# Altium schematic sheet [02] - Power.SchDoc
size A3
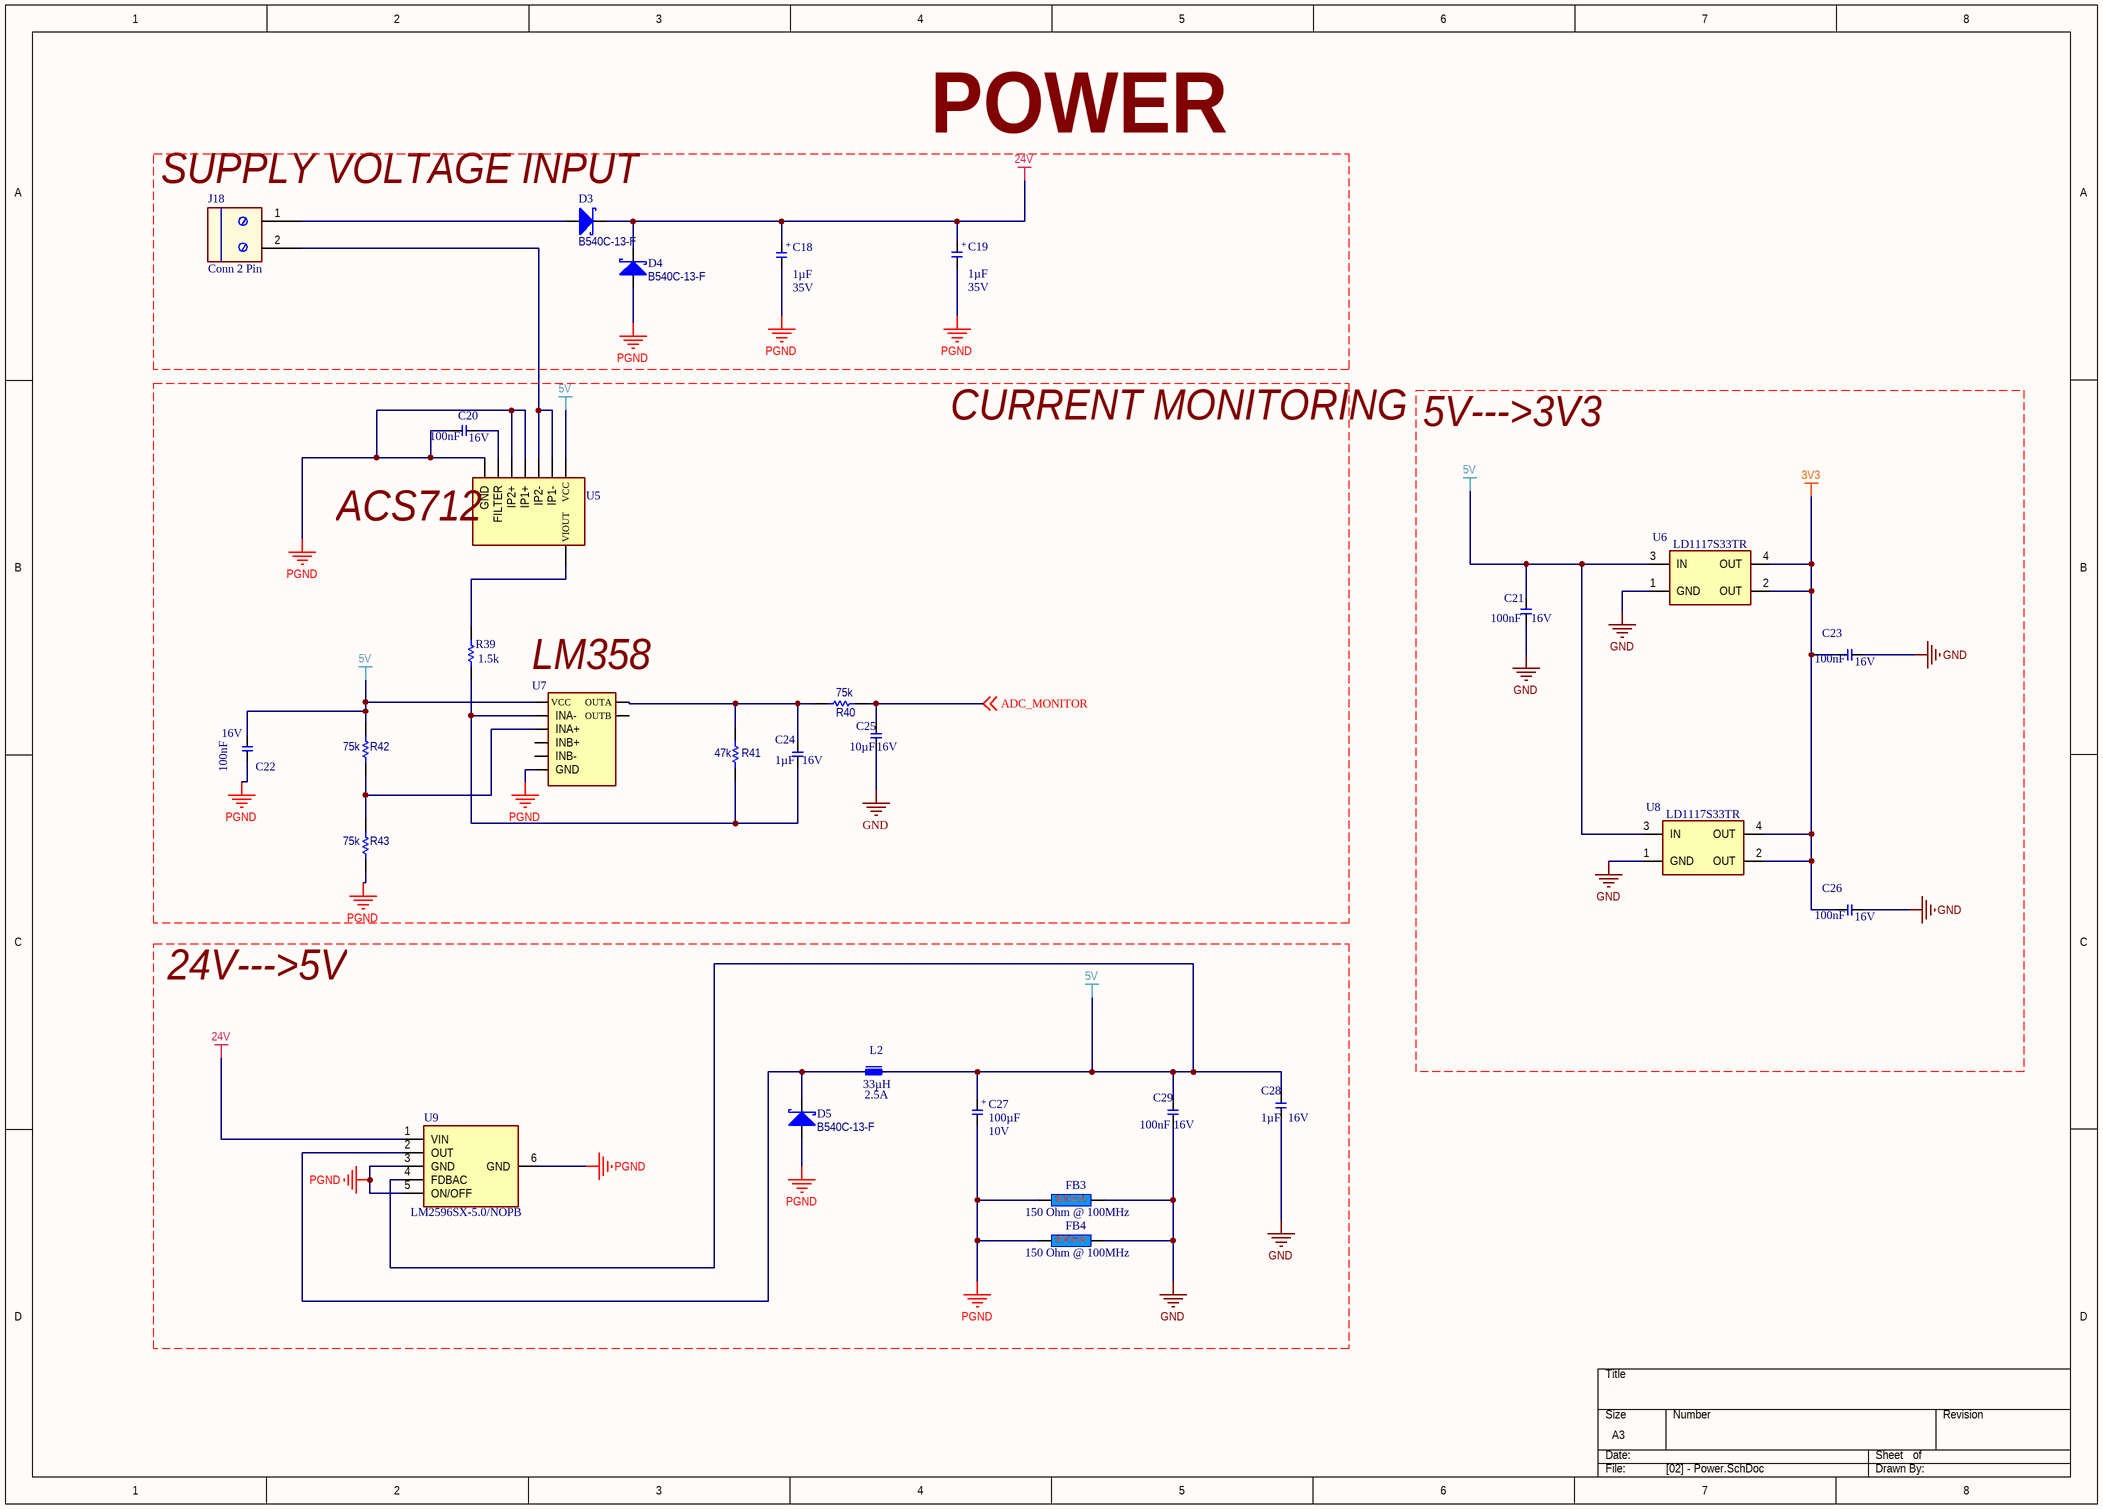
[diagram p0: [02] - Power.SchDoc]

## Parts
C18  Capacitance: 1µF  Voltage - Rated: 35V  [Case_A]  (hidden comment: CAP TANT 1UF 35V 10% 1206)
C19  Capacitance: 1µF  Voltage - Rated: 35V  [Case_A]  (hidden comment: CAP TANT 1UF 35V 10% 1206)
C20  Voltage - Rated: 16V  [C0805]  (hidden comment: 100nF)
C21  100nF  Voltage - Rated: 16V  [C0805]
C22  100nF  Voltage - Rated: 16V  [C0805]
C23  100nF  Voltage - Rated: 16V  [C0805]
C24  Voltage - Rated: 16V  [C0805]  (hidden comment: 1µF)
C25  10µF  Voltage - Rated: 16V  [C0805]
C26  100nF  Voltage - Rated: 16V  [C0805]
C27  Voltage - Rated: 10V  [Case_C]  (hidden comment: 100µF)
C28  1µF  Voltage - Rated: 16V  [C0805]
C29  100nF  Voltage - Rated: 16V  [C0805]
D3  B540C-13-F  [B520C-13-F]
D4  B540C-13-F  [B520C-13-F]
D5  B540C-13-F  [B520C-13-F]
FB3  150 Ohm @ 100MHz  [0805]
FB4  150 Ohm @ 100MHz  [0805]
J18  Conn 2 Pin  [Connector 2 Ways Pitch 3,81]
L2  Inductance: 33µH  Current Rating: 2.5A  [Bobin_SMD]  (hidden comment: L-IND 33UH 2.5A)
R39  1.5k  [R0805]
R40  Resistance (Ohms): 75k  [R1206]  (hidden comment: RES SMD 75K OHM)
R41  Resistance (Ohms): 47k  [R0805]  (hidden comment: RES SMD 47K OHM)
R42  Resistance (Ohms): 75k  [R1206]  (hidden comment: RES SMD 75K OHM)
R43  Resistance (Ohms): 75k  [R1206]  (hidden comment: RES SMD 75K OHM)
U5  SENSOR CURRENT HALL 5A AC/DC  [SOIC-8]  (value not drawn)
U6  Manufacturer Part Number: LD1117S33TR  [SOT-223_L]  (hidden comment: IC-LD1117S33TR)
U7  LM358 Series 7 mV Input Offset Dual Operational Amplifier - SOIC-8  [SOIC-8]  (value not drawn)
U8  Manufacturer Part Number: LD1117S33TR  [SOT-223_L]  (hidden comment: IC-LD1117S33TR)
U9  Manufacturer Part Number: LM2596SX-5.0/NOPB  [TO-263-5]  (hidden comment: IC-LM2596SX-5.0/NOPB)

## Nets
3V3: C23.2 C26.2 U6.2(OUT) U6.4(OUT) U8.2(OUT) U8.4(OUT)
5V: C21.2 C22.2 C27.1 C28.2 C29.2 L2.2 R42.1 U5.8(VCC) U6.3(IN) U7.8(VCC) U8.3(IN) U9.4(FDBAC)
24V: C18.1 C19.1 D3.1 D4.1 U9.1(VIN)
GND: C21.1 C23.1 C25.1 C26.1 C28.1 C29.1 FB3.2 FB4.2 U6.1(GND) U8.1(GND)
PGND: C18.2 C19.2 C20.2 C22.1 C27.2 D4.2 D5.2 FB3.1 FB4.1 R43.2 U5.1(IP1+) U5.2(IP2+) U5.5(GND) U7.4(GND) U9.3(GND) U9.5(ON/OFF) U9.6(GND)
ADC_MONITOR: C25.2 R40.2 ; off-sheet ADC_MONITOR
NetC20_1: C20.1 U5.6(FILTER)
NetC24_1: C24.1 R39.1 R41.2 U7.2(INA-)
NetC24_2: C24.2 R40.1 R41.1 U7.1(OUTA)
NetD3_2: D3.2 J18.1
NetD5_1: D5.1 L2.1 U9.2(OUT)
NetJ18_2: J18.2 U5.3(IP1-) U5.4(IP2-)
NetR39_2: R39.2 U5.7(VIOUT)
NetR42_2: R42.2 R43.1 U7.3(INA+)

Not connected (* = marked no-connect by the designer): U7 5(INB+) 6(INB-) 7(OUTB)

## Notes on the sheet
- POWER
- SUPPLY VOLTAGE INPUT
- CURRENT MONITORING
- 5V--->3V3
- (near U5) ACS712
- (near U7) LM358
- 24V--->5V
- (in symbol C-10UF,TANTAL C) +
- (in symbol C-T491A105K035AT) +

## Library data of the parts
C18 C19 = C-T491A105K035AT: Manufacturer: Kemet; Manufacturer Size Code: A; ESR (Equivalent Series Resistance): 7 Ohm; Type: Molded; Lifetime @ Temp.: 2000 Hrs @ 85°C; Supplier 1: Digi-Key; Manufacturer Part Number: T491A105K035AT; RoHS: RoHS Compliant; Pricing 1: 1=0.4, 10=0.354, 50=0.2146, 100=0.1768, 250=0.1414, 500=0.12878, 1000=0.11615 (USD); ComponentLink1URL: http://www.kemet.com/Lists/ProductCatalog/Attachments/254/KEM_T2005_T491.pdf; ComponentLink1Description: http://www.kemet.com/Lists/ProductCatalog/Attachments/254/KEM_T2005_T491.pdf; Category: Capacitors; Stock 1: 10565; Packaging: Cut Tape (CT); Tolerance: ±10%; Operating Temperature: -55°C ~ 125°C; Mounting Type: Surface Mount; Package / Case: 1206 (3216 Metric); Size / Dimension: 0.126" L x 0.063" W (3.20mm x 1.60mm); Height - Seated (Max): 0.071" (1.80mm); Lead Spacing: -; Features: General Purpose
C20-C23 C26 C29 = C-100NF,16V,0805: AVX - 0805YA103JAT2A - CAP, MLCC, C0G/NP0, 10NF, 16V, 0805; Tolerance: ±5%; Temperature Coefficient: C0G, NP0; Supplier 1: Digi-Key; Manufacturer: AVX; Manufacturer Part Number: 0805YA103JAT2A; RoHS: YES; Stock 1: 28062; Pricing 1: 1=0.29, 10=0.204, 25=0.1668, 50=0.1424, 100=0.1221, 250=0.10176, 500=0.09158, 1000=0.07733 (USD); ComponentLink1URL: http://www.avx.com/docs/Catalogs/ccog.pdf; ComponentLink1Description: http://www.avx.com/docs/Catalogs/ccog.pdf; Supplier Part Number 1: 478-1334-1-ND; ComponentLink2URL: http://www.farnell.com/datasheets/1825494.pdf; ComponentLink2Description: http://www.farnell.com/datasheets/1825494.pdf; Category: Capacitors; Packaging: Cut Tape (CT); Mounting Type: Surface Mount, MLCC; Operating Temperature: -55°C ~ 125°C; Applications: General Purpose; Ratings: -; Package / Case: 0805 (2012 Metric); Size / Dimension: 0.079" L x 0.049" W (2.01mm x 1.25mm); Height - Seated (Max): -; Thickness (Max): 0.037" (0.94mm); Lead Spacing: -; Features: -; Lead Style: -; ComponentLink3URL: http://datasheets.avx.com/C0GNP0-Dielectric.pdf; ComponentLink3Description: http://datasheets.avx.com/C0GNP0-Dielectric.pdf; Capacitance: 100nF
C24 C28 = C-1UF,16V,0805: AVX - 0805YC105KAT2A - CAP, MLCC, X7R, 1UF, 16V, 0805; Manufacturer: AVX Corporation; Tolerance: ±10%; Manufacturer Part Number: 0805YC105KAT2A; RoHS: RoHS Compliant; Capacitance: 1µF; Packaging: Cut Tape (CT); ComponentLink1URL: http://datasheets.avx.com/X7RDielectric.pdf; ComponentLink1Description: http://datasheets.avx.com/X7RDielectric.pdf; Supplier 1: Digi-Key; Category: Capacitors; Stock 1: 76930; Pricing 1: 1=0.19, 10=0.132, 25=0.0964, 50=0.075, 100=0.0622, 250=0.05148, 500=0.04362, 1000=0.03611 (USD); Temperature Coefficient: X7R; Mounting Type: Surface Mount, MLCC; Operating Temperature: -55°C ~ 125°C; Applications: General Purpose; Ratings: -; Package / Case: 0805 (2012 Metric); Size / Dimension: 0.079" L x 0.049" W (2.01mm x 1.25mm); Height - Seated (Max): -; Thickness (Max): 0.055" (1.40mm); Lead Spacing: -; Features: -; Lead Style: -; Supplier Part Number 1: 478-5034-1-ND
C25 = C-10UF,16V,0805: AVX - 0805YD106KAT2A - CAP, MLCC, X5R, 10UF, 16V, 0805; Manufacturer: AVX Corporation; Tolerance: ±10%; Supplier 1: Digi-Key; Manufacturer Part Number: 0805YD106KAT2A; RoHS: RoHS Compliant; Stock 1: 293738; Pricing 1: 1=0.18, 10=0.124, 25=0.0908, 50=0.0742, 100=0.0627, 250=0.05116, 500=0.0429, 1000=0.03795 (USD); Capacitance: 10µF; Packaging: Digi-Reel®; ComponentLink1URL: http://datasheets.avx.com/cx5r.pdf; ComponentLink1Description: http://datasheets.avx.com/cx5r.pdf; Supplier Part Number 1: 478-5165-6-ND; Category: Capacitors; Temperature Coefficient: X5R; Mounting Type: Surface Mount, MLCC; Operating Temperature: -55°C ~ 85°C; Applications: General Purpose; Ratings: -; Package / Case: 0805 (2012 Metric); Size / Dimension: 0.079" L x 0.049" W (2.01mm x 1.25mm); Height - Seated (Max): -; Thickness (Max): 0.055" (1.40mm); Lead Spacing: -; Features: -; Lead Style: -
C27 = C-10UF,TANTAL C: CAP TANT 100UF 10V 10% 2413; Manufacturer: Kemet; Manufacturer Part Number: T491C107K010AT; Manufacturer Size Code: C; ESR (Equivalent Series Resistance): 1.2 Ohm; Type: Molded; Lifetime @ Temp.: 2000 Hrs @ 85°C; Supplier 1: Digi-Key; RoHS: RoHS Compliant; Category: Capacitors; Stock 1: 1879; Pricing 1: 1=2.2, 10=1.804, 50=1.584, 100=1.276, 250=1.056 (USD); Packaging: Cut Tape (CT); Tolerance: ±10%; Operating Temperature: -55°C ~ 125°C; Mounting Type: Surface Mount; Package / Case: 2413 (6032 Metric); Size / Dimension: 0.236" L x 0.126" W (6.00mm x 3.20mm); Height - Seated (Max): 0.110" (2.80mm); Lead Spacing: -; Features: General Purpose; ComponentLink1URL: http://www.kemet.com/Lists/ProductCatalog/Attachments/254/KEM_T2005_T491.pdf; ComponentLink1Description: http://www.kemet.com/Lists/ProductCatalog/Attachments/254/KEM_T2005_T491.pdf; Supplier Part Number 1: 399-8338-1-ND; Capacitance: 100µF
D3-D5 = D-B540C-13-F SCHOTTKY 40V 5A SMC: DIODE SCHOTTKY 40V 5A SMC; Manufacturer: Diodes Incorporated; Voltage - Forward (Vf) (Max) @ If: 550mV @ 5A; Speed: Fast Recovery =< 500ns, > 200mA (Io); Current - Reverse Leakage @ Vr: 500µA @ 40V; Capacitance @ Vr, F: 300pF @ 4V, 1MHz; Diode Configuration: 1 Pair Series Connection; Current - Average Rectified (Io) (per Diode): 215mA (DC); Supplier 1: Digi-Key; Supplier Part Number 1: B540C-FDICT-ND; RoHS: RoHS Compliant; Category: Discrete Semiconductor Products; Stock 1: 21029; Pricing 1: 1=0.5, 10=0.426, 100=0.3179, 500=0.2497, 1000=0.1925 (USD); Packaging: Cut Tape (CT); Diode Type: Schottky; Voltage - DC Reverse (Vr) (Max): 40V; Current - Average Rectified (Io): 5A; Reverse Recovery Time (trr): -; Mounting Type: Surface Mount; Package / Case: DO-214AB, SMC; Supplier Device Package: SMC; Operating Temperature - Junction: -55°C ~ 125°C; ComponentLink1URL: http://www.diodes.com/_files/datasheets/ds13012.pdf; ComponentLink1Description: http://www.diodes.com/_files/datasheets/ds13012.pdf; Supplier 2: Digi-Key; Stock 2: 58594; Pricing 2: 1=0.13, 10=0.115, 100=0.0626, 500=0.0385, 1000=0.02627 (USD); ComponentLink2URL: http://www.nxp.com/documents/data_sheet/BAV99_SER.pdf; ComponentLink2Description: http://www.nxp.com/documents/data_sheet/BAV99_SER.pdf; Manufacturer Part Number: B540C-13-F; Supplier Part Number 2: 568-5005-1-ND
FB3 FB4 = L-150OHM,800MA: FERRITE 800MA 150 OHM 0805 SMD; Manufacturer: Laird-Signal Integrity Products; Manufacturer Part Number: LI0805H151R-10; DC Resistance (DCR): 150 mOhm Max; Filter Type: Differential Mode - Single; Supplier 1: Digi-Key; RoHS: RoHS Compliant; Category: Filters; Stock 1: 418596; Pricing 1: 1=0.1, 10=0.07, 25=0.064, 50=0.0574, 100=0.0421, 250=0.03064, 500=0.02808, 1000=0.02424 (USD); Packaging: Cut Tape (CT); Impedance @ Frequency: 150 Ohm @ 100MHz; Current Rating: 800mA; Package / Case: 0805 (2012 Metric); Mounting Type: Surface Mount; Height (Max): 0.043" (1.10mm); Size / Dimension: 0.079" L x 0.049" W (2.00mm x 1.25mm); ComponentLink1URL: http://www.lairdtech.com/WorkArea/linkit.aspx?LinkIdentifier=id&ItemID=4912; ComponentLink1Description: http://www.lairdtech.com/WorkArea/linkit.aspx?LinkIdentifier=id&ItemID=4912; Supplier Part Number 1: 240-2384-1-ND
J18 = Conn 2 Pin 3.81mm: TERM BLOCK HDR 2POS R/A 3.81MM; Manufacturer: Phoenix Contact; Manufacturer Part Number: 1803277; Number of Positions: 2; Number of Levels: 1; Pitch: 0.150" (3.81mm); Header Orientation: 90°, Right Angle; Current - IEC: 8A; Voltage - IEC: 250V; Voltage - UL: 300V; Supplier 1: Digi-Key; RoHS: RoHS Compliant; Category: Connectors, Interconnects; Stock 1: 4266; Pricing 1: 1=0.75, 10=0.716, 50=0.6844, 100=0.6658, 250=0.6222, 500=0.57242, 1000=0.5185, 2500=0.4941, 5000=0.4636 (USD); Packaging: Bulk; Type: Header, Male Pins, Shrouded (4 Side); Positions Per Level: 2; Plug Wire Entry: -; Termination Style: Solder; Mounting Type: Through Hole; Current - UL: 8A; Wire Gauge or Range - AWG: -; Wire Gauge or Range - mm²: -; Color: Green; Operating Temperature: -; Contact Mating Finish: Tin; Features: -; ComponentLink1URL: http://media.digikey.com/pdf/Data%20Sheets/Phoenix%20Contact%20PDFs/1803277.pdf; ComponentLink1Description: http://media.digikey.com/pdf/Data%20Sheets/Phoenix%20Contact%20PDFs/1803277.pdf; Supplier Part Number 1: 277-1206-ND
L2 = L-IND 33UH 2.5A: FIXED IND 33UH 2.5A 79 MOHM SMD; Manufacturer: Wurth Electronics Inc; Manufacturer Part Number: 7447714330; Type: Wirewound; Material - Core: Ferrite; Tolerance: ±20%; Current - Saturation: 2.9A; Shielding: Shielded; DC Resistance (DCR): 79 mOhm Max; Frequency - Self Resonant: 11.1MHz; Frequency - Test: 100kHz; Supplier 1: Digi-Key; RoHS: RoHS Compliant; Category: Inductors, Coils, Chokes; Stock 1: 137; Pricing 1: 1=2.76, 10=2.415, 50=2.2424, 100=2.1562, 250=2.07 (USD); Packaging: Cut Tape (CT); Q @ Freq: -; Ratings: -; Operating Temperature: -40°C ~ 125°C; Mounting Type: Surface Mount; Package / Case: Nonstandard; Size / Dimension: 0.394" L x 0.394" W (10.00mm x 10.00mm); Height - Seated (Max): 0.197" (5.00mm); ComponentLink1URL: http://katalog.we-online.de/pbs/datasheet/7447714330.pdf; ComponentLink1Description: http://katalog.we-online.de/pbs/datasheet/7447714330.pdf; Supplier Part Number 1: 732-2993-1-ND
R39 = R-1.5K,%1,0805: RES SMD 1.5K OHM 1% 1/8W 0805; Manufacturer: Yageo; Manufacturer Part Number: RC0805FR-071K5L; Temperature Coefficient: ±100ppm/°C; Power (Watts): 0.125W, 1/8W; Supplier 1: Digi-Key; RoHS: RoHS Compliant; Stock 1: 815764; Pricing 1: 1=0.1, 10=0.021, 25=0.0152, 100=0.0084, 250=0.00644, 500=0.00514, 1000=0.00379, 2500=0.00329 (USD); Packaging: Digi-Reel®; ComponentLink1URL: http://www.yageo.com/documents/recent/PYu-RC_Group_51_RoHS_L_04.pdf; ComponentLink1Description: http://www.yageo.com/documents/recent/PYu-RC_Group_51_RoHS_L_04.pdf; Supplier Part Number 1: 311-1.50KCRDKR-ND; Category: Resistors; Tolerance: ±1%; Composition: Thick Film; Features: Moisture Resistant; Operating Temperature: -55°C ~ 155°C; Package / Case: 0805 (2012 Metric); Supplier Device Package: 0805; Size / Dimension: 0.079" L x 0.049" W (2.00mm x 1.25mm); Height: 0.024" (0.60mm); Number of Terminations: 2; Resistance (Ohms): 1.5k
R40 R42 R43 = R-75k,1206: RES SMD 75K OHM 1% 1/4W 1206; Manufacturer: Vishay Dale; Manufacturer Part Number: CRCW120675K0FKEA; Temperature Coefficient: ±100ppm/°C; Power (Watts): 0.25W, 1/4W; Supplier 1: Digi-Key; RoHS: RoHS Compliant; Category: Resistors; Stock 1: 28544; Pricing 1: 1=0.1, 10=0.054, 25=0.0392, 50=0.03, 100=0.0221, 250=0.01684, 500=0.01346, 1000=0.00991, 2500=0.0086 (USD); Height: 0.024" (0.60mm); Package / Case: 1206 (3216 Metric); Packaging: Cut Tape (CT); Tolerance: ±1%; ComponentLink1URL: http://www.vishay.com/docs/20035/dcrcwe3.pdf; ComponentLink1Description: http://www.vishay.com/docs/20035/dcrcwe3.pdf; Supplier Part Number 1: 541-75.0KFCT-ND; Part Status: Active; Composition: Thick Film; Features: Automotive AEC-Q200; Operating Temperature: -55°C ~ 155°C; Supplier Device Package: 1206; Size / Dimension: 0.126" L x 0.063" W (3.20mm x 1.60mm); Number of Terminations: 2; Failure Rate: -
R41 = R-47K,0805: RES SMD 47K OHM 1% 1/8W 0805; Manufacturer: Samsung Electro-Mechanics America, Inc.; Manufacturer Part Number: RC2012F473CS; Temperature Coefficient: ±100ppm/°C; Power (Watts): 0.125W, 1/8W; Regulator Topology: Positive Adjustable; Voltage - Output: 1.24 V ~ 15 V; Current - Output: 3A; Voltage - Dropout (Typical): 0.45V @ 3A; Number of Regulators: 1; Voltage - Input: 3 V ~ 16 V; Supplier 1: Digi-Key; RoHS: RoHS Compliant; Category: Resistors; Stock 1: 29088; Pricing 1: 1=0.1, 10=0.022, 25=0.016, 50=0.0124, 100=0.0091, 500=0.00554, 1000=0.00408 (USD); Package / Case: 0805 (2012 Metric); Packaging: Cut Tape (CT); Tolerance: ±1%; ComponentLink1URL: http://media.digikey.com/pdf/Data%20Sheets/Samsung%20PDFs/RC_Series_ds.pdf; ComponentLink1Description: http://media.digikey.com/pdf/Data%20Sheets/Samsung%20PDFs/RC_Series_ds.pdf; Supplier Part Number 1: 1276-5377-1-ND; Part Status: Active; Composition: Thick Film; Features: Moisture Resistant; Operating Temperature: -55°C ~ 155°C; Supplier Device Package: 0805; Size / Dimension: 0.079" L x 0.049" W (2.00mm x 1.25mm); Height: 0.024" (0.60mm); Number of Terminations: 2; Failure Rate: -; Current - Limit (Min): 3A; Mounting Type: Surface Mount; ComponentLink2URL: http://www.microchip.com/mymicrochip/filehandler.aspx?ddocname=en580808; ComponentLink2Description: http://www.microchip.com/mymicrochip/filehandler.aspx?ddocname=en580808
U5 = IC-ACS 712: ACS712ELCTR-05B-T; Manufacturer: Allegro MicroSystems, LLC; Sensor Type: Hall Effect, Open Loop; Number of Channels: 1; Output: Ratiometric, Voltage; Sensitivity: 185mV/A; Frequency: DC ~ 80kHz; Linearity: ±1.5%; Voltage - Supply: 5V; Response Time: 5µs; Current - Supply (Max): 13mA; Polarization: Bidirectional; Manufacturer Part Number: ACS712ELCTR-05B-T; RoHS: RoHS Compliant; Category: Sensors, Transducers; Packaging: Cut Tape (CT); For Measuring: AC/DC; Current - Sensing: 5A; Accuracy: ±1.5%; Operating Temperature: -40°C ~ 85°C; Mounting Type: Surface Mount; Package / Case: 8-SOIC (0.154", 3.90mm Width); ComponentLink1URL: http://www.allegromicro.com/en/Products/Part_Numbers/0712/0712.pdf; ComponentLink1Description: http://www.allegromicro.com/en/Products/Part_Numbers/0712/0712.pdf; Supplier 1: Digi-Key; Stock 1: 19223; Pricing 1: 1=4.82, 10=3.76, 50=2.6962, 100=2.6252, 250=2.41232, 500=2.19946, 1000=2.05755 (USD); Supplier Part Number 1: 620-1189-6-ND
U6 U8 = IC-LD1117S33TR: IC REG LDO 3.3V 0.8A SOT223; Manufacturer: STMicroelectronics; Regulator Topology: Positive Fixed; Current - Output: 800mA; Voltage - Dropout (Typical): 1.1V @ 800mA; Number of Regulators: 1; Voltage - Input: Up to 15V; Supplier 1: Digi-Key; RoHS: RoHS Compliant; Stock 1: 5854; Pricing 1: 1=0.46, 10=0.373, 100=0.2541, 500=0.1902, 1000=0.14245 (USD); ComponentLink1URL: http://www.st.com/web/en/resource/technical/document/datasheet/CD00000544.pdf; ComponentLink1Description: http://www.st.com/web/en/resource/technical/document/datasheet/CD00000544.pdf; Supplier Part Number 1: 497-1242-1-ND; Category: Integrated Circuits (ICs); Packaging: Cut Tape (CT); Voltage - Output: 3.3V; Current - Limit (Min): -; Operating Temperature: 0°C ~ 125°C; Mounting Type: Surface Mount; Package / Case: TO-261-4, TO-261AA; Supplier Device Package: SOT-223
U7 = IC-LM358: LM358MXFSCT-ND; Manufacturer: STMicroelectronics; Manufacturer Part Number: LM358DT; Amplifier Type: General Purpose; Number of Circuits: 2; Slew Rate: 0.6 V/µs; Gain Bandwidth Product: 1.1MHz; Current - Input Bias: 20nA; Voltage - Input Offset: 2mV; Current - Supply: 700µA; Current - Output / Channel: 60mA; Voltage - Supply, Single/Dual (±): 3 V ~ 30 V, ±1.5 V ~ 15 V; lead_free_status: Lead Free; mounting_style: Surface Mount; slew_rate: 0.6; supply_current: 0.0005; pin_count: 8; Supplier 1: Octopart; RoHS: RoHS Compliant; Category: Integrated Circuits (ICs); Stock 1: 28677; Pricing 1: 1=0.39000, 10=0.31700, 100=0.21580, 500=0.16154, 1000=0.12099 (USD); Packaging: Cut Tape (CT); Output Type: -; -3db Bandwidth: -; Operating Temperature: 0°C ~ 70°C; Mounting Type: Surface Mount; Package / Case: 8-SOIC (0.154", 3.90mm Width); Supplier Device Package: 8-SO; ComponentLink1URL: http://www.st.com/web/en/resource/technical/document/datasheet/CD00000464.pdf; ComponentLink1Description: http://www.st.com/web/en/resource/technical/document/datasheet/CD00000464.pdf; Supplier Part Number 1: Digi-Key - LM358MXFSCT-ND; rohs_status: Compliant; reach_svhc_compliance: No SVHC; case_package: SOP; number_of_circuits: 2; lifecycle_status: Active; number_of_channels: 2; Octopart Url: http://octopart.com/lm358mx-fairchild+semiconductor-414618; Manufacturer Part Detail Url: https://octopart-clicks.com/click/track?country=TR&ak=8157f166&ct=hyperlinks&sig=09e5379&sid=1595&ppid=414618&hlid=17769068; Seller Landing  Url: https://octopart-clicks.com/click/track?country=TR&ak=8157f166&sig=08734bf&sid=459&ppid=414618&vpid=34030540&ct=offers; OctopartID: c87b0177be8717bc; ComponentLink2URL: http://datasheet.octopart.com/LM358MX-Fairchild-Semiconductor-datasheet-10506076.pdf; ComponentLink2Description: http://datasheet.octopart.com/LM358MX-Fairchild-Semiconductor-datasheet-10506076.pdf; ComponentLink3URL: http://datasheet.octopart.com/LM358MX-Fairchild-datasheet-2089.pdf; ComponentLink3Description: http://datasheet.octopart.com/LM358MX-Fairchild-datasheet-2089.pdf; ComponentLink4URL: http://sigma.octopart.com/33068652/technical_drawing/Fairchild-Semiconductor-LM358MX.pdf; ComponentLink4Description: http://sigma.octopart.com/33068652/technical_drawing/Fairchild-Semiconductor-LM358MX.pdf; ComponentLink5URL: http://sigma.octopart.com/17345426/technical_drawing/Fairchild-Semiconductor-LM358MX.pdf; ComponentLink5Description: http://sigma.octopart.com/17345426/technical_drawing/Fairchild-Semiconductor-LM358MX.pdf; ComponentLink6URL: http://datasheet.octopart.com/LM358MX-Fairchild-Semiconductor-datasheet-10506378.pdf; ComponentLink6Description: http://datasheet.octopart.com/LM358MX-Fairchild-Semiconductor-datasheet-10506378.pdf; ComponentLink7URL: http://datasheet.octopart.com/LM358MX-Fairchild-Semiconductor-datasheet-14043864.pdf; ComponentLink7Description: http://datasheet.octopart.com/LM358MX-Fairchild-Semiconductor-datasheet-14043864.pdf; ComponentLink8URL: http://datasheet.octopart.com/LM358MX-Fairchild-Semiconductor-datasheet-13519245.pdf; ComponentLink8Description: http://datasheet.octopart.com/LM358MX-Fairchild-Semiconductor-datasheet-13519245.pdf
U9 = IC-LM2596SX-5.0/NOPB: Voltage Regulators - Switching Regulators 150 KHZ 3A STEP-DOWN VLTG REG; Manufacturer: Texas Instruments; Input Voltage MAX: 40 V; Number of Outputs: 1 Output; Output Voltage: 5 V; Switching Frequency: 173 kHz; Topology: Buck; Input Voltage MIN: 4.5 V; Supplier 1: Mouser; RoHS: RoHS Compliant; Category: Voltage Regulators - Switching Regulators; Stock 1: 1902; Pricing 1: 1=4.45, 10=3.98, 25=3.57, 50=3.42, 100=3.26, 250=2.94, 500=2.64, 1000=2.39, 1500=2.03 (USD); Operating Temperature Range: - 40 C to + 85 C; Output Current: 3 A; Package/Case: TO-263-5; Packaging: Reel; Series: LM2596; Type: Inverting, Step Down; Brand: Texas Instruments; Mounting Style: SMD/SMT; Maximum Operating Temperature: + 125 C; Minimum Operating Temperature: - 40 C; Standard Pack Qty: 500; RoHS - Mouser: Y; Minimum Order Quantity: 1; Reeling: True; ComponentLink1URL: http://www.mouser.com/ds/2/405/snvs124c-317006.pdf; ComponentLink1Description: http://www.mouser.com/ds/2/405/snvs124c-317006.pdf; Supplier Part Number 1: 926-LM2596SX-5.0NOPB